# Altium schematic sheet 1 - main.SchDoc
size A4
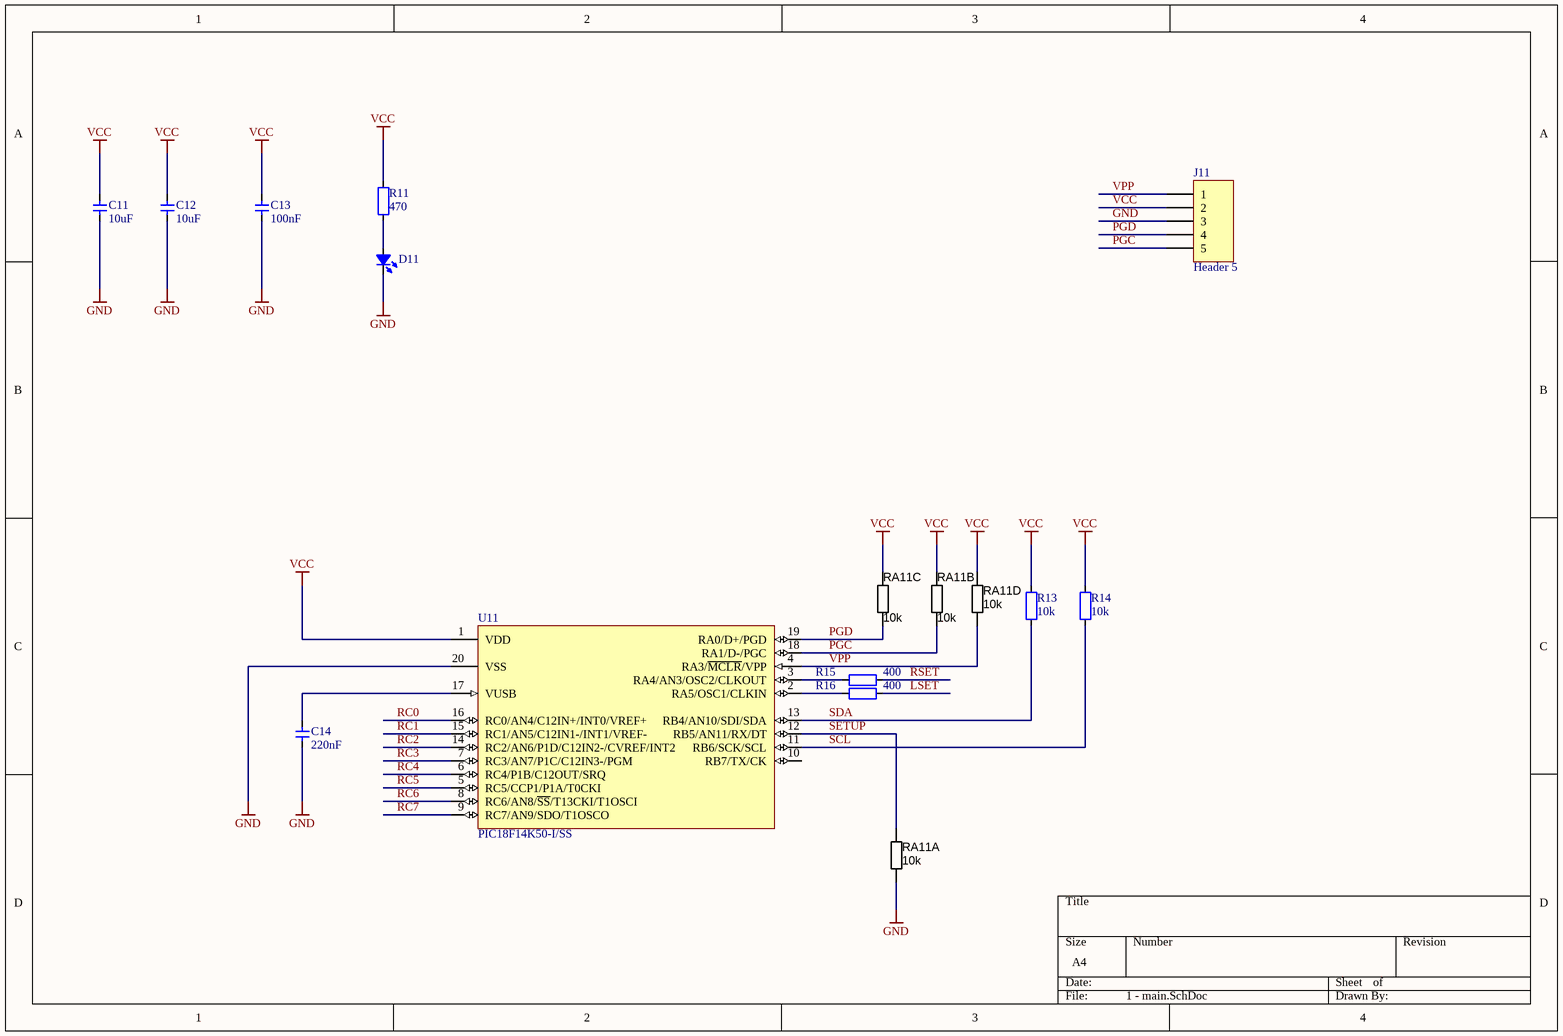
[diagram p0: 1 - main.SchDoc]

## Parts
C11  value 10uF  [CAP_0603]  (hidden comment: Cap_0603)
C12  value 10uF  [CAP_0603]  (hidden comment: Cap_0603)
C13  value 100nF  [CAP_0603]  (hidden comment: Cap_0603)
C14  value 220nF  [CAP_0603]  (hidden comment: Cap_0603)
D11  LED_0603  [LED_0603_RED]  (value not drawn)
J11  Header 5  [HDR1X5]
R11  value 470  [RES_0603]  (hidden comment: Res_0603)
R13  value 10k  [RES_0603]  (hidden comment: Res_0603)
R14  value 10k  [RES_0603]  (hidden comment: Res_0603)
R15  value 400  [RES_0603]  (hidden comment: Res_0603)
R16  value 400  [RES_0603]  (hidden comment: Res_0603)
RA11  value 10k  [RESCAXS50P160X320X70-8N]  (hidden comment: Film Res Pack)  (parts A,B,C,D of 4)
U11  PIC18F14K50-I/SS  [SSOP-SS20_N]

## Nets
GND: C11.1 C12.1 C13.1 C14.1 D11.2(K) J11.3 RA11.8 U11.20(VSS)
VCC: C11.2 C12.2 C13.2 J11.2 R11.2 R13.2 R14.2 RA11.5 RA11.6 RA11.7 U11.1(VDD)
LSET: R16.1
PGC: J11.5 RA11.2 U11.18(RA1/D-/PGC)
PGD: J11.4 RA11.3 U11.19(RA0/D+/PGD)
RC0: U11.16(RC0/AN4/C12IN+/INT0/VREF+)
RC1: U11.15(RC1/AN5/C12IN1-/INT1/VREF-)
RC2: U11.14(RC2/AN6/P1D/C12IN2-/CVREF/INT2)
RC3: U11.7(RC3/AN7/P1C/C12IN3-/PGM)
RC4: U11.6(RC4/P1B/C12OUT/SRQ)
RC5: U11.5(RC5/CCP1/P1A/T0CKI)
RC6: U11.8(RC6/AN8/~{SS}/T13CKI/T1OSCI)
RC7: U11.9(RC7/AN9/SDO/T1OSCO)
RSET: R15.1
SCL: R14.1 U11.11(RB6/SCK/SCL)
SDA: R13.1 U11.13(RB4/AN10/SDI/SDA)
SETUP: RA11.1 U11.12(RB5/AN11/RX/DT)
VPP: J11.1 RA11.4 U11.4(RA3/~{MCLR}/VPP)
NetC14_2: C14.2 U11.17(VUSB)
NetD11_1: D11.1(A) R11.1
NetR15_2: R15.2 U11.3(RA4/AN3/OSC2/CLKOUT)
NetR16_2: R16.2 U11.2(RA5/OSC1/CLKIN)

Not connected (* = marked no-connect by the designer): U11 10(RB7/TX/CK)

## Library data of the parts
C11-C14 = Cap_0603: Capacitor
D11 = LED_0603: LED
J11 = Header 5: Header, 5-Pin; LatestRevisionDate: 17-Jul-2002; LatestRevisionNote: Re-released for DXP Platform.; Publisher: Altium Limited
R11 R13-R16 = Res_0603: Resistor
RA11 = RESPACK_1K_5%_4X: Resistor array 1K Ohm 4-pack 62.5mW 5% 4x1608 SMD; Manufacturer 1: Yageo; Manufacturer Part Number 1: YC164-JR-071KL; Ratings: 1/16 W; Number of Resistors: 4; Circuit Type: Isolated; SCDType: source; Package / Case: 1206 (3216 Metric), Convex; Tolerance: ±5%; Number of Pins: 8; Power Per Element: 62.5mW; Mounting Type: Surface Mount; Supplier Device Package: 4 x 0603; Operating Temperature: -55°C ~ 155°C; ComponentLink1URL: http://www.yageo.com/documents/recent/PYu-YC_TC164_51_RoHS_L_3.pdf; ComponentLink1Description: http://www.yageo.com/documents/recent/PYu-YC_TC164_51_RoHS_L_3.pdf; Supplier 1: Digi-Key; Supplier Part Number 1: YC164J-1.0KCT-ND; Supplier 2: Digi-Key; Supplier Part Number 2: CRA6S81.0KCT-ND; Manufacturer 2: Vishay Dale; Manufacturer Part Number 2: CRA06S0831K00JTA; ComponentLink2URL: http://www.vishay.com/doc?31002; ComponentLink2Description: http://www.vishay.com/doc?31002; Supplier 3: Digi-Key; Supplier Part Number 3: RAVF164DJT1K00CT-ND; Manufacturer 3: Stackpole Electronics Inc; Manufacturer Part Number 3: RAVF164DJT1K00; RoHS 3: RoHS Compliant; Size / Dimension: 0.126" L x 0.063" W (3.20mm x 1.60mm); ComponentLink3URL: http://www.seielect.com/Catalog/SEI-RAVF.pdf; ComponentLink3Description: http://www.seielect.com/Catalog/SEI-RAVF.pdf; Supplier 4: Digi-Key; Supplier Part Number 4: Y9102CT-ND; Manufacturer 4: Panasonic Electronic Components; Manufacturer Part Number 4: EXB-38V102JV; RoHS 4: RoHS Compliant; ComponentLink4URL: http://industrial.panasonic.com/www-cgi/jvcr13pz.cgi?E+PZ+3+AOC0001+EXB38V102JV+7+WW; ComponentLink4Description: http://industrial.panasonic.com/www-cgi/jvcr13pz.cgi?E+PZ+3+AOC0001+EXB38V102JV+7+WW; Manufacturer Part Number 5: 4D03WGJ0102T5E; Manufacturer 5: Royal Ohm
U11 = PIC18F14K50-I/SS: USB Flash Microcontroller with nanoWatt XLP Technology, 20-pin SSOP, Industrial Temperature; Published: 2-Dec-2009; DatasheetVersion: revC, Mar-2009; PackageVersion: revBB, Aug-2009; PackageReference: SSOP-SS20; Publisher: Altium Limited; PackageDescription: 20-Lead Plastic Shrink Small Outline (SS) - 5.3mm Body [SSOP]; Supplier 1: Digi-Key; Supplier Part Number 1: PIC18F14K50-I/SS-ND; Supplier 2: Farnell; Supplier Part Number 2: 1648504; Code_JEDEC: MO-150; Code_IPC: SOP65P780-20; ComponentLink1Description: Datasheet; ComponentLink1URL: http://ww1.microchip.com/downloads/en/DeviceDoc/41350C.pdf; ComponentLink2Description: Packaging Specification; ComponentLink2URL: http://www.microchip.com/stellent/groups/techpub_sg/documents/packagingspec/en012702.pdf; ComponentLink3Description: Microchip.com Home; ComponentLink3URL: http://www.microchip.com/